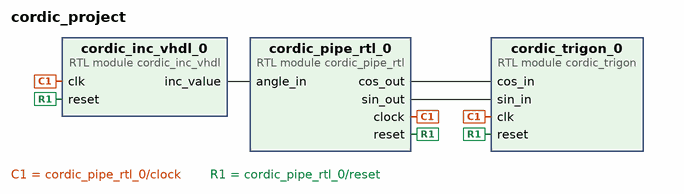
[diagram p0: block diagram of the top level]
# Vivado block design cordic_project, xc7z020clg484-1, Vivado 2016.4
create_bd_design cordic_project

create_bd_cell -type module -reference cordic_pipe_rtl cordic_pipe_rtl_0
create_bd_cell -type module -reference cordic_trigon cordic_trigon_0
create_bd_cell -type module -reference cordic_inc_vhdl cordic_inc_vhdl_0

# ---- connections ----

connect_bd_net [get_bd_pins cordic_inc_vhdl_0/inc_value] [get_bd_pins cordic_pipe_rtl_0/angle_in]
connect_bd_net [get_bd_pins cordic_pipe_rtl_0/clock] [get_bd_pins cordic_trigon_0/clk] [get_bd_pins cordic_inc_vhdl_0/clk]
connect_bd_net [get_bd_pins cordic_pipe_rtl_0/reset] [get_bd_pins cordic_trigon_0/reset] [get_bd_pins cordic_inc_vhdl_0/reset]
connect_bd_net [get_bd_pins cordic_pipe_rtl_0/cos_out] [get_bd_pins cordic_trigon_0/cos_in]
connect_bd_net [get_bd_pins cordic_pipe_rtl_0/sin_out] [get_bd_pins cordic_trigon_0/sin_in]

validate_bd_design
save_bd_design
